# Altium schematic sheet SH6 - BROADCOM ENCODER.SchDoc: Broadcom Encoder
size B; CheckedBy: Wolfgang Windholtz; Engineer: Sahil Kale; Revision: 1; SheetNumber: 6; SheetTotal: 6
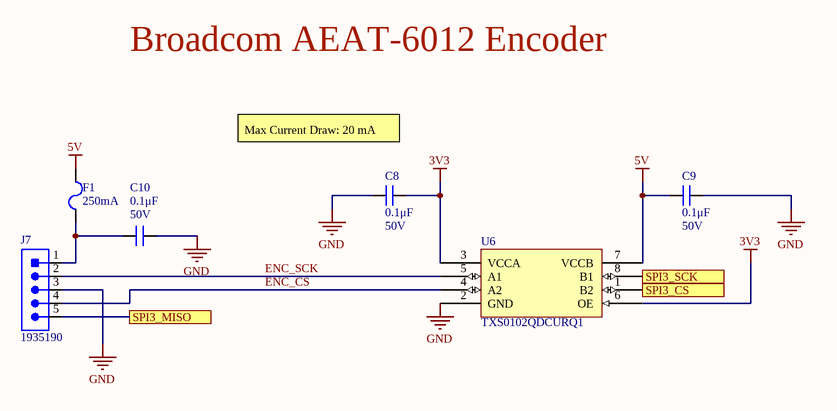
[diagram p0: SH6 - BROADCOM ENCODER.SchDoc]

## Parts
C8  value 0.1μF  Voltage Rating: 50V  [CAP2012]  (hidden comment: CAP_0.1uF_50V_0805)
C9  value 0.1μF  Voltage Rating: 50V  [CAP2012]  (hidden comment: CAP_0.1uF_50V_0805)
C10  value 0.1μF  Voltage Rating: 50V  [CAP2012]  (hidden comment: CAP_0.1uF_50V_0805)
F1  Current Rating: 250mA  [FUSE_1206]  (hidden comment: FUSE_250mA_1206)
J7  CON_5POS_SCREW_TERM  [1935190]  (value not drawn)
U6  IC_LVL_SHIFTER_2_CH  [TXS0102QDCURQ1]  (value not drawn)

## Ports
SPI3_CS, SPI3_MISO, SPI3_SCK

## Nets
3V3: C8.2 U6.3(VCCA) U6.6(OE)
5V: C9.1 F1.1 U6.7(VCCB)
GND: C8.1 C9.2 C10.1 J7.3 U6.2(GND)
ENC_CS: J7.4 U6.4(A2)
ENC_SCK: J7.2 U6.5(A1)
SPI3_CS: U6.1(B2) ; port SPI3_CS
SPI3_MISO: J7.5 ; port SPI3_MISO
SPI3_SCK: U6.8(B1) ; port SPI3_SCK
NetC10_2: C10.2 F1.2 J7.1

## Notes on the sheet
- Broadcom AEAT-6012 Encoder
- Max Current Draw: 20 mA
- Title:
- Project:
- Date:
- Rev:
- Reviewer:
- Engineer:
- Sheet:
- of

## Library data of the parts
C8 C9 = CAP_0.1uF_50V_0805: CAP CER 0.1UF 50V X7R 0805; Manufacturer 1: Murata Electronics; Manufacturer Part Number 1: GCM21BR71H104KA37K; Package/Footprint: 0805; Mounting Type: SMD; Supplier 1: Digi-Key; Supplier Part Number 1: 490-8049-1-ND; Dielectric: X7R; LCSC Part #: C49678
C10 = CAP_0.1uF_50V_0805: CAP CER 0.1UF 50V X7R 0805; Manufacturer Part Number 1: GCM21BR71H104KA37K; Manufacturer 1: Murata Electronics; Package/Footprint: 0805; Supplier Part Number 1: 490-8049-1-ND; Supplier 1: Digi-Key; Dielectric: X7R; Mounting Type: SMD; LCSC Part #: C49678
F1 = FUSE_250mA_1206: FUSE BOARD MNT 250MA 125VAC/VDC; Manufacturer 1: Littelfuse; Manufacturer Part Number 1: 0466.250NR; Package/Footprint: 1206; Supplier 1: Digi-Key; Supplier Part Number 1: F1452CT-ND; Mounting Type: SMD
J7 = CON_5POS_SCREW_TERM: TERM BLK 5POS SIDE ENTRY 5MM; Manufacturer 1: Phoenix Contact; Package/Footprint: TH; Supplier 1: Digi-Key; Mounting Type: TH; Supplier Part Number 1: 277-1580-ND; Manufacturer Part Number 1: 1935190
U6 = IC_LVL_SHIFTER_2_CH: IC TRNSLTR BIDIRECTIONAL US8; Manufacturer 1: Texas Instruments; Package Body Material: Plastic; Interface IC Type: INTERFACE CIRCUIT; Number of Functions: 1; Max Supply Voltage: 4.6V; Min Supply Voltage: -0.5V; Supply Voltage-Nom: 3.3V; Supplier 1: Digi-Key; RoHS: Yes; Category: Interface ICs; Stock 1: 25079; Pricing 1: 1=0.82000, 10=0.71900, 25=0.67600, 100=0.55150, 250=0.51232, 500=0.43600, 1000=0.34880 (USD); Package Code: VSSOP; Number of Pins: 8; Package Shape: Rectangular; Terminal Finish: Nickel; Min Operating Temperature: -40°C; Max Operating Temperature: 125°C; JESD-609 Code: e4; JESD-30 Code: R-PDSO-G8; Moisture Sensitivity Level: 2; Package Style: SMALL OUTLINE, VERY THIN PROFILE, SHRINK PITCHMeter; Peak Reflow Temperature (Cel): 260°C; Surface Mount: Yes; Terminal Form: Gull Wing; Terminal Position: DUAL; Length: 2.3mm; Width: 2mm; Height - Seated (Max): 0.9mm; Terminal Pitch: 0.5mm; Temperature Grade: AUTOMOTIVE; ComponentLink1URL: https://www.ti.com:443/lit/ds/symlink/txs0102-q1.pdf?src-supplier=IHS+Markit; ComponentLink1Description: https://www.ti.com:443/lit/ds/symlink/txs0102-q1.pdf?src-supplier=IHS+Markit; ComponentLink2URL: https://datasheet.ciiva.com/48438/txs0102-q1-48438266.pdf?src-supplier=Avnet; ComponentLink2Description: https://datasheet.ciiva.com/48438/txs0102-q1-48438266.pdf?src-supplier=Avnet; Supplier Part Number 1: 296-37938-1-ND; Manufacturer Part Number 1: TXS0102QDCURQ1